# EAGLE schematic Shutter Pod Schematic (EAGLE 5.10)
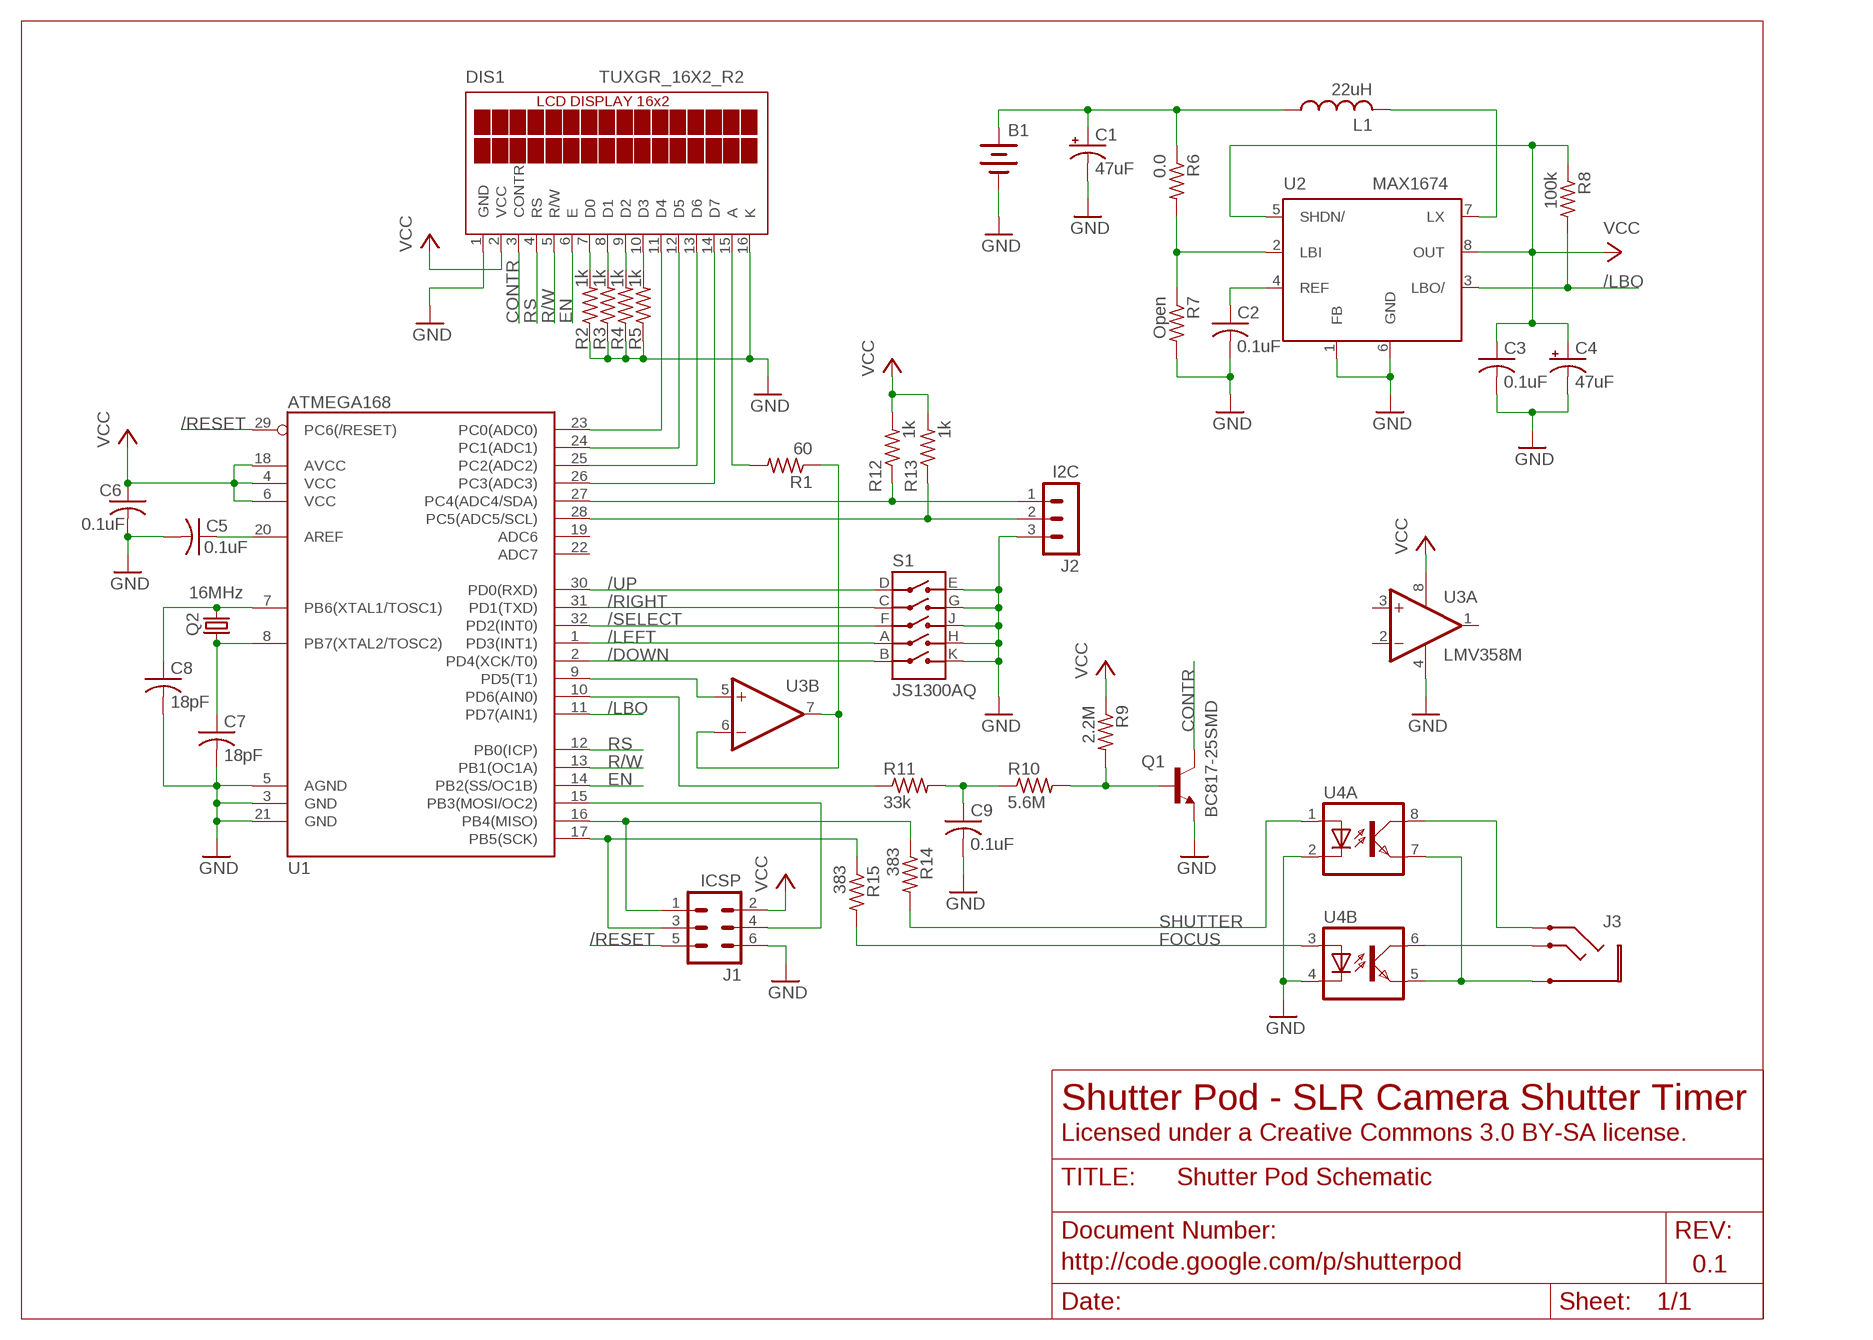
[diagram p0: schematic, sheet 1]

## Parts
B1  BATTERY  [BATTERY]
C1  47uF  CPOL-USSMCD  [SMC_D]
C2  0.1uF  C-USC0805  [C0805]
C3  0.1uF  C-USC0805  [C0805]
C4  47uF  CPOL-USSMCD  [SMC_D]
C5  0.1uF  C-USC0805  [C0805]
C6  0.1uF  C-USC0805  [C0805]
C7  18pF  C-USC0805  [C0805]
C8  18pF  C-USC0805  [C0805]
C9  0.1uF  C-USC0805  [C0805]
DIS1  TUXGR_16X2_R2  [TUXGR_16X2_R2]
J1  ICSP  MA03-2W  [MA03-2W]
J2  I2C  MA03-1W  [MA03-1W]
J3  2.5MM_AUDIO  [161-2625-E]
L1  22uH  L-USL2220P  [L2220P]
Q1  BC817-25SMD  [SOT23-BEC]
Q2  16MHz  CRYSTALHC49UP  [HC49UP]
R1  60  R-US_R0805  [R0805]
R2  1k  R-US_R0805  [R0805]
R3  1k  R-US_R0805  [R0805]
R4  1k  R-US_R0805  [R0805]
R5  1k  R-US_R0805  [R0805]
R6  0.0  R-US_R0805  [R0805]
R7  Open  R-US_R0805  [R0805]
R8  100k  R-US_R0805  [R0805]
R9  2.2M  R-US_R0805  [R0805]
R10  5.6M  R-US_R0805  [R0805]
R11  33k  R-US_R0805  [R0805]
R12  1k  R-US_R0805  [R0805]
R13  1k  R-US_R0805  [R0805]
R14  383  R-US_R0805  [R0805]
R15  383  R-US_R0805  [R0805]
S1  JS1300AQ  [JS1300AQ]
U1  ATMEGA168  [TQFP32-08]
U2  MAX1674  [UMAX8]
U3  LMV358M  [SO08]
U4  PS2501L-2-A  [DIL8-SMD]

## Nets
/DOWN: S1.B U1.2(PD4(XCK/T0))
/LBO: R8.2 U1.11(PD7(AIN1)) U2.3(LBO/)
/LEFT: S1.A U1.1(PD3(INT1))
/RESET: J1.5 U1.29(PC6(/RESET))
/RIGHT: S1.C U1.31(PD1(TXD))
/SELECT: S1.F U1.32(PD2(INT0))
/UP: S1.D U1.30(PD0(RXD))
CONTR: DIS1.3(CONTR) Q1.C
EN: DIS1.6(E) U1.14(PB2(SS/OC1B))
FOCUS: R15.2 U4.3(B:A)
GND: B1.1(NEGATIVE) C1.- C2.2 C3.2 C4.- C5.2 C6.2 C7.2 C8.2 C9.2 DIS1.1(GND) DIS1.16(K) J1.6 J2.3 Q1.E R2.1 R3.1 R4.1 R5.1 R7.2 S1.E S1.G S1.H S1.J S1.K U1.3(GND) U1.5(AGND) U1.21(GND) U2.1(FB) U2.6(GND) U3.4(P:V-) U4.2(A:C) U4.4(B:C)
MISO: J1.1 R14.1 U1.16(PB4(MISO))
MOSI: J1.4 U1.15(PB3(MOSI/OC2))
N$1: DIS1.11(D4) U1.23(PC0(ADC0))
N$2: DIS1.12(D5) U1.24(PC1(ADC1))
N$3: DIS1.13(D6) U1.25(PC2(ADC2))
N$4: DIS1.14(D7) U1.26(PC3(ADC3))
N$5: U1.9(PD5(T1)) U3.5(B:+IN)
N$6: R11.1 U1.10(PD6(AIN0))
N$7: Q1.B R9.2 R10.2
N$8: R1.1 U3.6(B:-IN) U3.7(B:OUT)
N$9: DIS1.15(A) R1.2
N$10: B1.2(POSITIVE) C1.+ L1.1 R6.1
N$11: C5.1 U1.20(AREF)
N$12: DIS1.7(D0) R2.2
N$13: DIS1.8(D1) R3.2
N$14: DIS1.9(D2) R4.2
N$15: DIS1.10(D3) R5.2
N$16: C2.1 U2.4(REF)
N$18: R6.2 R7.1 U2.2(LBI)
N$19: C9.1 R10.1 R11.2
N$20: L1.2 U2.7(LX)
N$21: C8.1 Q2.2 U1.7(PB6(XTAL1/TOSC1))
N$22: C7.1 Q2.1 U1.8(PB7(XTAL2/TOSC2))
N$23: J3.SA(SLEEVE) U4.5(B:EMIT) U4.7(A:EMIT)
N$24: J3.T(TIP) U4.6(B:COL)
N$28: J3.R(RING) U4.8(A:COL)
R/W: DIS1.5(R/W) U1.13(PB1(OC1A))
RS: DIS1.4(RS) U1.12(PB0(ICP))
SCK: J1.3 R15.1 U1.17(PB5(SCK))
SCL: J2.2 R13.1 U1.28(PC5(ADC5/SCL))
SDA: J2.1 R12.1 U1.27(PC4(ADC4/SDA))
SHUTTER: R14.2 U4.1(A:A)
VCC: C3.1 C4.+ C6.1 DIS1.2(VCC) J1.2 R8.1 R9.1 R12.2 R13.2 U1.4(VCC) U1.6(VCC) U1.18(AVCC) U2.5(SHDN/) U2.8(OUT) U3.8(P:V+)
Unconnected: U1.19(ADC6) U1.22(ADC7) U3.1(A:OUT) U3.2(A:-IN) U3.3(A:+IN)

## Notes on the sheet
- Shutter Pod - SLR Camera Shutter Timer
- Licensed under a Creative Commons 3.0 BY-SA license.
- http://code.google.com/p/shutterpod | 0.1

## Library data of the parts
B1 = shutter-pod:BATTERY
C1 C4 = rcl:CPOL-US: POLARIZED CAPACITOR, American symbol
C2 C3 C5-C9 = rcl:C-US: CAPACITOR, American symbol
DIS1 = display-lcd:TUXGR_16X2_R2: Tuxgraphics LCD display 16x2 characters reflective, without background light Source: tuxgr_12x2_r2.pdf
J1 = con-lstb:MA03-2W
J2 = con-lstb:MA03-1W
J3 = shutter-pod:2.5MM_AUDIO
L1 = rcl:L-US: INDUCTOR, American symbol
Q1 = transistor-npn:BC817*: NPN Transistor
Q2 = crystal:CRYSTAL: CRYSTAL
R1-R15 = rcl:R-US_: RESISTOR, American symbol
S1 = switch-misc:JS1300AQ
U1 = SparkFun:ATMEGA168
U2 = maxim:MAX1674: DC/DC CONVERTER
U3 = linear:LMV358?*: Dual General Purpose, Low Voltage, Rail-to-Rail Output Operational Amplifiers Source: http://www.national.com/mpf/LM/LMV321.html http://www.national.com/dt/lmv_qual.pdf
U4 = optocoupler:PS2501L-2-A